# EAGLE schematic board2 (EAGLE 6.5.0)
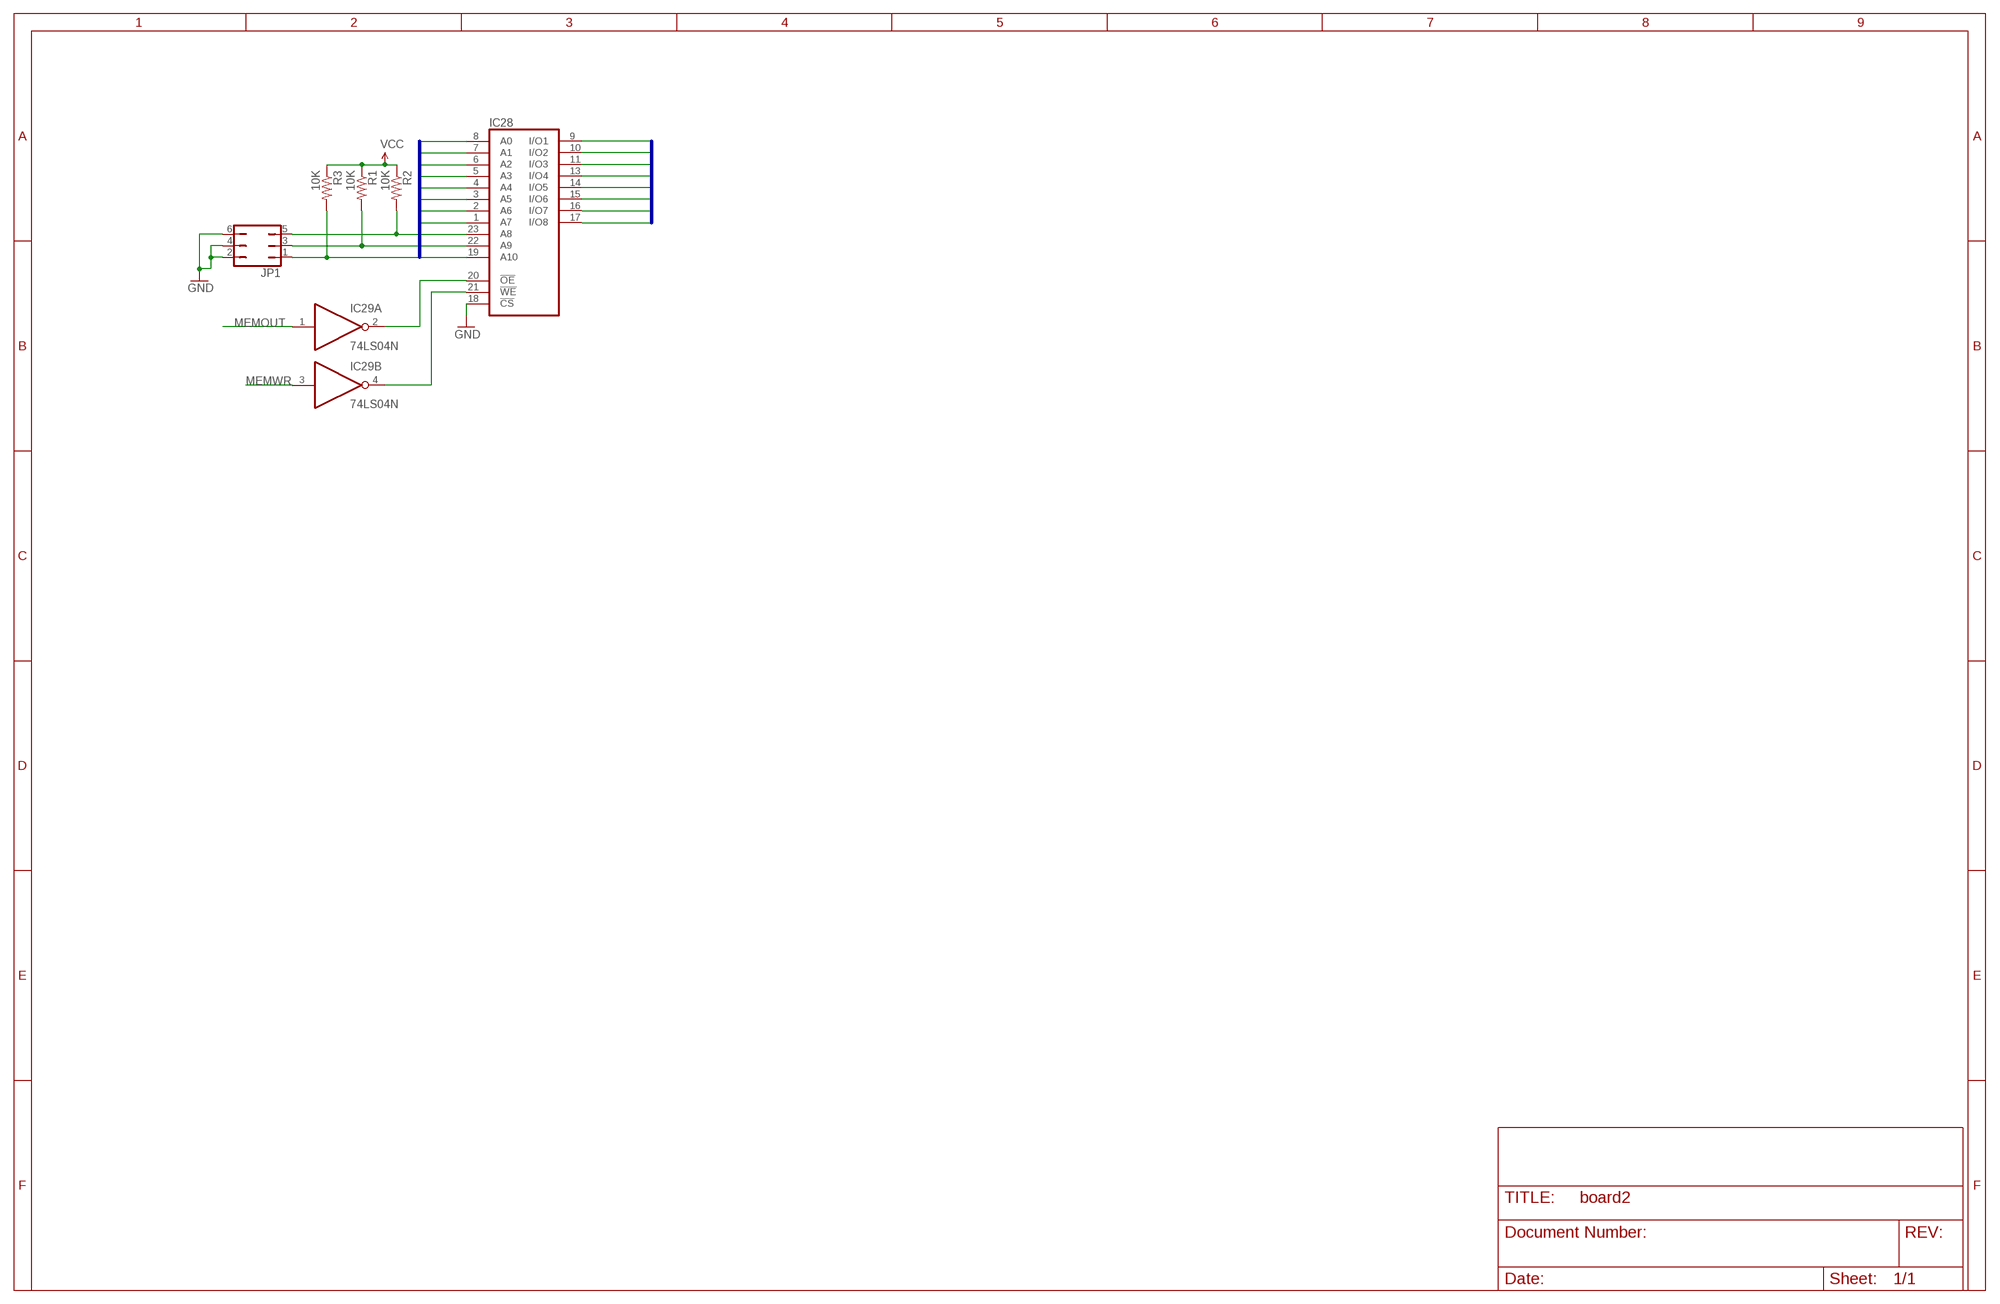
[diagram p0: schematic, sheet 1]

## Parts
IC28  6116P  [DIL24-6]
IC29  74LS04N  [DIL14]
JP1  JP3Q  [JP3Q]
R1  10K  R-US_0309/12  [0309/12]
R2  10K  R-US_0309/12  [0309/12]
R3  10K  R-US_0309/12  [0309/12]

## Nets
ADDR0: IC28.8(A0)
ADDR1: IC28.7(A1)
ADDR2: IC28.6(A2)
ADDR3: IC28.5(A3)
ADDR4: IC28.4(A4)
ADDR5: IC28.3(A5)
ADDR6: IC28.2(A6)
ADDR7: IC28.1(A7)
DATA0: IC28.9(I/O1)
DATA1: IC28.10(I/O2)
DATA2: IC28.11(I/O3)
DATA3: IC28.13(I/O4)
DATA4: IC28.14(I/O5)
DATA5: IC28.15(I/O6)
DATA6: IC28.16(I/O7)
DATA7: IC28.17(I/O8)
GND: IC28.18(!CS) JP1.2 JP1.4 JP1.6
MEMOUT: IC29.1(A:I)
MEMWR: IC29.3(B:I)
N$18: IC28.19(A10) JP1.1 R3.2
N$20: IC28.20(!OE) IC29.2(A:O)
N$21: IC28.23(A8) JP1.5 R2.2
N$22: IC28.21(!WE) IC29.4(B:O)
N$23: IC28.22(A9) JP1.3 R1.2
VCC: R1.1 R2.1 R3.1
Unconnected: IC29.5(C:I) IC29.6(C:O) IC29.8(D:O) IC29.9(D:I) IC29.10(E:O) IC29.11(E:I) IC29.12(F:O) IC29.13(F:I)

## Buses
DATA[0..7]
ADDR[0..7]

## Power pins joined to a net without a drawn wire
GND: IC28.12(GND) IC29.7(P:GND)
VCC: IC28.24(VCC) IC29.14(P:VCC)

## Library data of the parts
IC28 = memory-idt:6116P: MEMORY; OC_FARNELL: unknown; OC_NEWARK: unknown
IC29 = 74xx-us:74*04: Hex INVERTER
JP1 = jumper:JP3Q: JUMPER
R1-R3 = resistor:R-US_: RESISTOR, American symbol